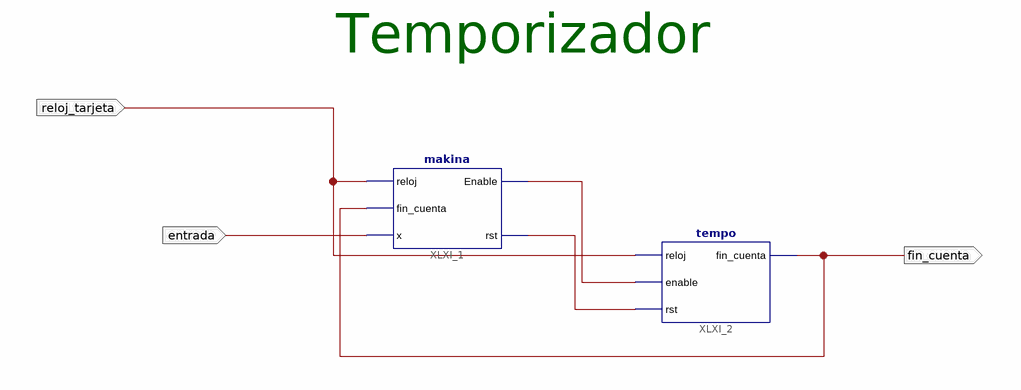
[diagram p0: schematic sheet 1]
// Xilinx ISE schematic temporizador.sch (spartan6) as structural Verilog: 2 symbols, 3 ports
module temporizador (
  input  entrada,
  input  reloj_tarjeta,
  output fin_cuenta
);

  wire XLXN_5, XLXN_6;

  makina XLXI_1 (.reloj(reloj_tarjeta), .fin_cuenta(fin_cuenta), .x(entrada), .Enable(XLXN_5), .rst(XLXN_6));
  tempo XLXI_2 (.reloj(reloj_tarjeta), .enable(XLXN_5), .rst(XLXN_6), .fin_cuenta(fin_cuenta));

  // Notes on the sheet:
  //   Temporizador
endmodule
